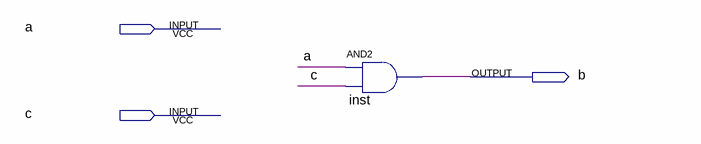
[diagram p0: schematic sheet]
// Quartus schematic new.bdf as structural Verilog: 1 symbols, 3 pins
module \new  (
  input  a,
  input  c,
  output b
);

  and inst (b, a, c);
endmodule
